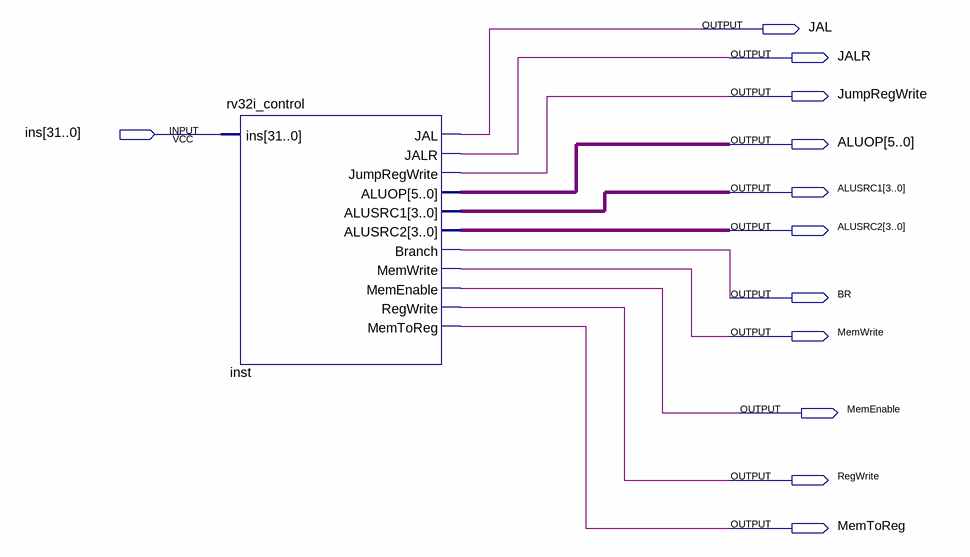
[diagram p0: schematic sheet]
// Quartus schematic rv32i_control_tester.bdf as structural Verilog: 1 symbols, 12 pins
module rv32i_control_tester (
  input  [31:0] ins,
  output JAL,
  output JALR,
  output JumpRegWrite,
  output [5:0] ALUOP,
  output [3:0] ALUSRC1,
  output [3:0] ALUSRC2,
  output BR,
  output MemWrite,
  output MemEnable,
  output RegWrite,
  output MemToReg
);

  rv32i_control inst (
    .ins(ins), .JAL(JAL), .JALR(JALR), .JumpRegWrite(JumpRegWrite), .ALUOP(ALUOP), .ALUSRC1(ALUSRC1),
    .ALUSRC2(ALUSRC2), .Branch(BR), .MemWrite(MemWrite), .MemEnable(MemEnable), .RegWrite(RegWrite),
    .MemToReg(MemToReg));
endmodule
